# Altium schematic sheet Sheet1.SchDoc
size A3
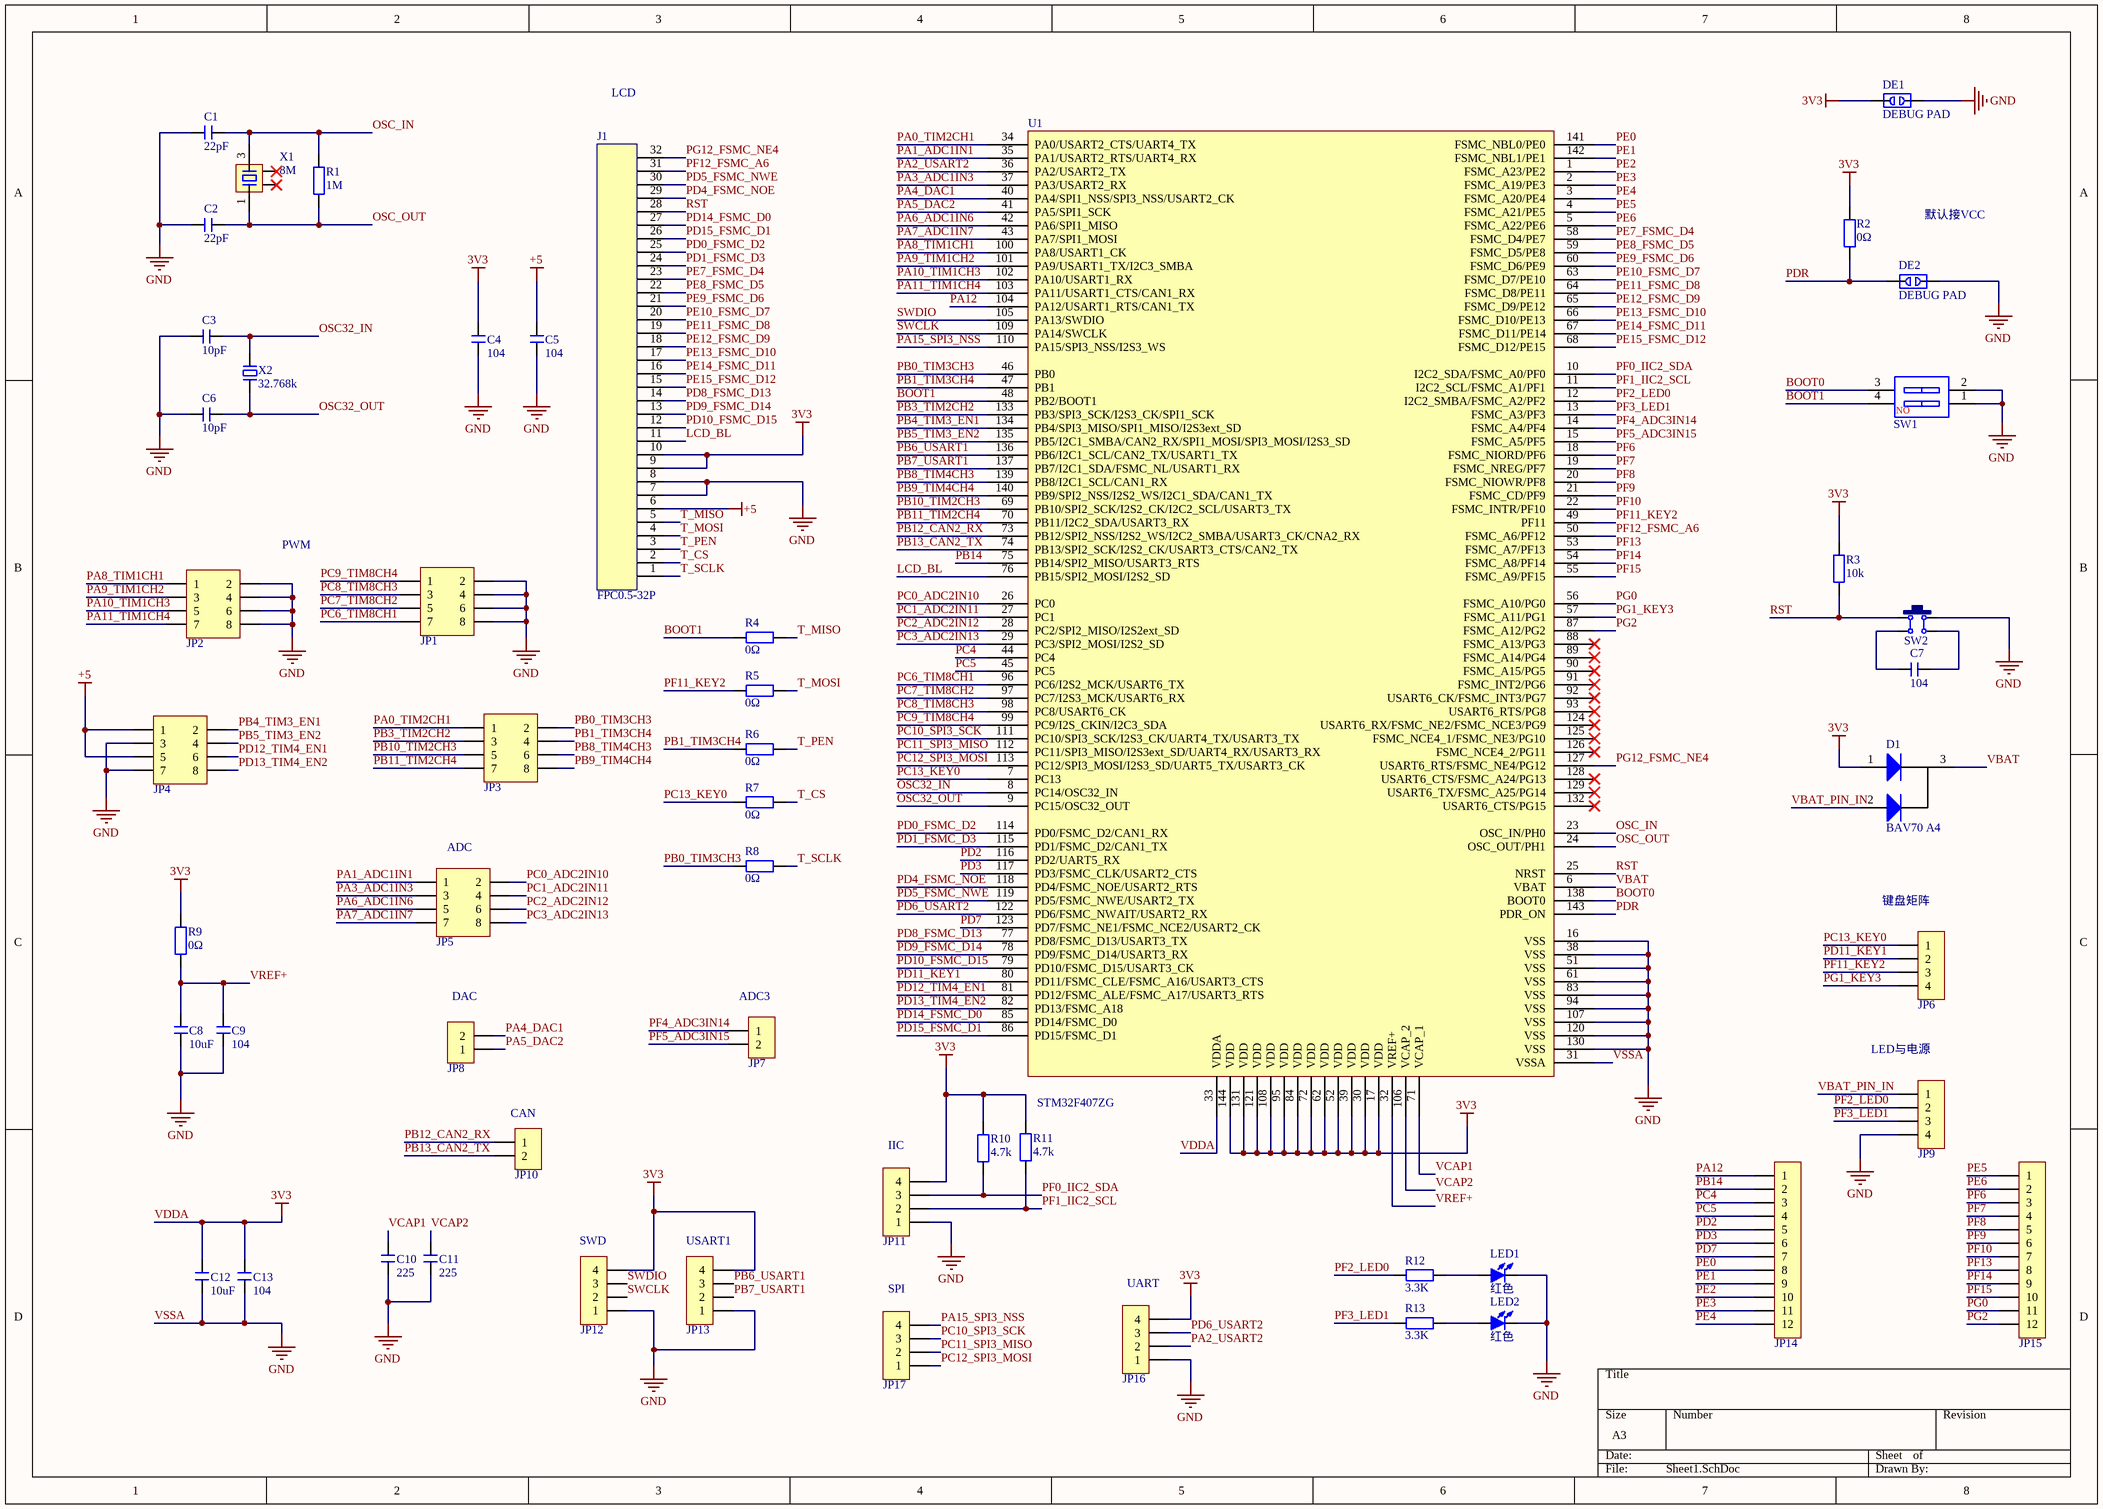
[diagram p0: Sheet1.SchDoc]

## Parts
C1  22pF  [C 0603_L]
C2  22pF  [C 0603_L]
C3  10pF  [C 0603_L]
C4  104  [C 0603_L]
C5  104  [C 0603_L]
C6  10pF  [C 0603_L]
C7  104  [C 0603_L]
C8  10uF  [C 0603_L]
C9  104  [C 0603_L]
C10  225  [C 0603_L]
C11  225  [C 0603_L]
C12  10uF  [C 0603_L]
C13  104  [C 0603_L]
D1  BAV70 A4  [SOT-23(SOT-23-3)]
DE1  DEBUG PAD  [DEBUG_A]
DE2  DEBUG PAD  [DEBUG_A]
J1  FPC0.5-32P  [FPC0.5-32P]
JP1  Header 4X2  [HDR2.54-LI-2x4P]  (value not drawn)
JP2  Header 4X2  [HDR2.54-LI-2x4P]  (value not drawn)
JP3  Header 4X2  [HDR2.54-LI-2x4P]  (value not drawn)
JP4  Header 4X2  [HDR2.54-LI-2x4P]  (value not drawn)
JP5  Header 4X2  [HDR2.54-LI-2x4P]  (value not drawn)
JP6  HDR-1X4  [HDR2.54-LI-4P]  (value not drawn)
JP7  HDR-1X2  [KF128-3.81-2P]  (value not drawn)
JP8  HDR-1X2  [HDR2.54-LI-2P]  (value not drawn)
JP9  HDR-1X4  [HDR2.54-LI-4P]  (value not drawn)
JP10  HDR-1X2  [KF350-2P]  (value not drawn)
JP11  HDR-1X4  [HDR2.54-LI-4P]  (value not drawn)
JP12  HDR-1X4  [HDR2.54-LI-4P]  (value not drawn)
JP13  HDR-1X4  [HDR2.54-LI-4P]  (value not drawn)
JP14  HDR-1X12  [HDR2.54-LI-12P]  (value not drawn)
JP15  HDR-1X12  [HDR2.54-LI-12P]  (value not drawn)
JP16  HDR-1X4  [HDR2.54-LI-4P]  (value not drawn)
JP17  HDR-1X4  [HDR2.54-LI-4P]  (value not drawn)
LED1  红色  [LED 0603R]
LED2  红色  [LED 0603B]
R1  1M  [R 0603_L]
R2  0Ω  [R 0603_L]
R3  10k  [R 0603_L]
R4  0Ω  [R 0603_L]
R5  0Ω  [R 0603_L]
R6  0Ω  [R 0603_L]
R7  0Ω  [R 0603_L]
R8  0Ω  [R 0603_L]
R9  0Ω  [R 0603_L]
R10  4.7k  [R 0603_L]
R11  4.7k  [R 0603_L]
R12  3.3K  [R 0603_L]
R13  3.3K  [R 0603_L]
SW1  CSW-2P  [CSW DIP-2P]  (value not drawn)
SW2  6x6x5  [TSW SMD-6*6*4.3]  (value not drawn)
U1  STM32F407ZG  [LQFP144 20X20_L]
X1  8M  [OSC 1612-4P]
X2  32.768k  [OSC HC-49S]

## Nets
+5: C5.2 J1.6 JP4.1 JP4.5
VDDA: C4.2 C12.2 C13.2 D1.1(A) DE1.1 J1.9 J1.10 JP11.4 JP12.4 JP13.4 JP16.4 R2.2 R3.1 R9.2 R10.1 R11.1 U1.17(VDD) U1.30(VDD) U1.33(VDDA) U1.39(VDD) U1.52(VDD) U1.62(VDD) U1.72(VDD) U1.84(VDD) U1.95(VDD) U1.108(VDD) U1.121(VDD) U1.131(VDD) U1.144(VDD)  [also labelled 3V3]
VSSA: C1.2 C2.2 C3.2 C4.1 C5.1 C6.2 C8.1 C9.1 C10.1 C11.1 C12.1 C13.1 DE1.2 DE2.2 J1.7 J1.8 JP1.2 JP1.4 JP1.6 JP1.8 JP2.2 JP2.4 JP2.6 JP2.8 JP4.3 JP4.7 JP9.4 JP11.1 JP12.1 JP13.1 JP16.1 LED1.2(K) LED2.2(K) SW1.1 SW1.2 SW2.2 U1.16(VSS) U1.31(VSSA) U1.38(VSS) U1.51(VSS) U1.61(VSS) U1.83(VSS) U1.94(VSS) U1.107(VSS) U1.120(VSS) U1.130(VSS)  [also labelled GND]
BOOT0: SW1.3 U1.138(BOOT0)
BOOT1: R4.2 SW1.4 U1.48(PB2/BOOT1)
LCD_BL: J1.11 U1.76(PB15/SPI2_MOSI/I2S2_SD)
OSC32_IN: C3.1 U1.8(PC14/OSC32_IN) X2.2
OSC32_OUT: C6.1 U1.9(PC15/OSC32_OUT) X2.1
OSC_IN: C1.1 R1.1 U1.23(OSC_IN/PH0) X1.3
OSC_OUT: C2.1 R1.2 U1.24(OSC_OUT/PH1) X1.1
PA0_TIM2CH1: JP3.1 U1.34(PA0/USART2_CTS/UART4_TX)
PA1_ADC1IN1: JP5.1 U1.35(PA1/USART2_RTS/UART4_RX)
PA2_USART2: JP16.2 U1.36(PA2/USART2_TX)
PA3_ADC1IN3: JP5.3 U1.37(PA3/USART2_RX)
PA4_DAC1: JP8.2 U1.40(PA4/SPI1_NSS/SPI3_NSS/USART2_CK)
PA5_DAC2: JP8.1 U1.41(PA5/SPI1_SCK)
PA6_ADC1IN6: JP5.5 U1.42(PA6/SPI1_MISO)
PA7_ADC1IN7: JP5.7 U1.43(PA7/SPI1_MOSI)
PA8_TIM1CH1: JP2.1 U1.100(PA8/USART1_CK)
PA9_TIM1CH2: JP2.3 U1.101(PA9/USART1_TX/I2C3_SMBA)
PA10_TIM1CH3: JP2.5 U1.102(PA10/USART1_RX)
PA11_TIM1CH4: JP2.7 U1.103(PA11/USART1_CTS/CAN1_RX)
PA12: JP14.1 U1.104(PA12/USART1_RTS/CAN1_TX)
PA15_SPI3_NSS: JP17.4 U1.110(PA15/SPI3_NSS/I2S3_WS)
PB0_TIM3CH3: JP3.2 R8.2 U1.46(PB0)
PB1_TIM3CH4: JP3.4 R6.2 U1.47(PB1)
PB3_TIM2CH2: JP3.3 U1.133(PB3/SPI3_SCK/I2S3_CK/SPI1_SCK)
PB4_TIM3_EN1: JP4.2 U1.134(PB4/SPI3_MISO/SPI1_MISO/I2S3ext_SD)
PB5_TIM3_EN2: JP4.4 U1.135(PB5/I2C1_SMBA/CAN2_RX/SPI1_MOSI/SPI3_MOSI/I2S3_SD)
PB6_USART1: JP13.3 U1.136(PB6/I2C1_SCL/CAN2_TX/USART1_TX)
PB7_USART1: JP13.2 U1.137(PB7/I2C1_SDA/FSMC_NL/USART1_RX)
PB8_TIM4CH3: JP3.6 U1.139(PB8/I2C1_SCL/CAN1_RX)
PB9_TIM4CH4: JP3.8 U1.140(PB9/SPI2_NSS/I2S2_WS/I2C1_SDA/CAN1_TX)
PB10_TIM2CH3: JP3.5 U1.69(PB10/SPI2_SCK/I2S2_CK/I2C2_SCL/USART3_TX)
PB11_TIM2CH4: JP3.7 U1.70(PB11/I2C2_SDA/USART3_RX)
PB12_CAN2_RX: JP10.1 U1.73(PB12/SPI2_NSS/I2S2_WS/I2C2_SMBA/USART3_CK/CNA2_RX)
PB13_CAN2_TX: JP10.2 U1.74(PB13/SPI2_SCK/I2S2_CK/USART3_CTS/CAN2_TX)
PB14: JP14.2 U1.75(PB14/SPI2_MISO/USART3_RTS)
PC0_ADC2IN10: JP5.2 U1.26(PC0)
PC1_ADC2IN11: JP5.4 U1.27(PC1)
PC2_ADC2IN12: JP5.6 U1.28(PC2/SPI2_MISO/I2S2ext_SD)
PC3_ADC2IN13: JP5.8 U1.29(PC3/SPI2_MOSI/I2S2_SD)
PC4: JP14.3 U1.44(PC4)
PC5: JP14.4 U1.45(PC5)
PC6_TIM8CH1: JP1.7 U1.96(PC6/I2S2_MCK/USART6_TX)
PC7_TIM8CH2: JP1.5 U1.97(PC7/I2S3_MCK/USART6_RX)
PC8_TIM8CH3: JP1.3 U1.98(PC8/USART6_CK)
PC9_TIM8CH4: JP1.1 U1.99(PC9/I2S_CKIN/I2C3_SDA)
PC10_SPI3_SCK: JP17.3 U1.111(PC10/SPI3_SCK/I2S3_CK/UART4_TX/USART3_TX)
PC11_SPI3_MISO: JP17.2 U1.112(PC11/SPI3_MISO/I2S3ext_SD/UART4_RX/USART3_RX)
PC12_SPI3_MOSI: JP17.1 U1.113(PC12/SPI3_MOSI/I2S3_SD/UART5_TX/USART3_CK)
PC13_KEY0: JP6.1 R7.2 U1.7(PC13)
PD0_FSMC_D2: J1.25 U1.114(PD0/FSMC_D2/CAN1_RX)
PD1_FSMC_D3: J1.24 U1.115(PD1/FSMC_D2/CAN1_TX)
PD2: JP14.5 U1.116(PD2/UART5_RX)
PD3: JP14.6 U1.117(PD3/FSMC_CLK/USART2_CTS)
PD4_FSMC_NOE: J1.29 U1.118(PD4/FSMC_NOE/USART2_RTS)
PD5_FSMC_NWE: J1.30 U1.119(PD5/FSMC_NWE/USART2_TX)
PD6_USART2: JP16.3 U1.122(PD6/FSMC_NWAIT/USART2_RX)
PD7: JP14.7 U1.123(PD7/FSMC_NE1/FSMC_NCE2/USART2_CK)
PD8_FSMC_D13: J1.14 U1.77(PD8/FSMC_D13/USART3_TX)
PD9_FSMC_D14: J1.13 U1.78(PD9/FSMC_D14/USART3_RX)
PD10_FSMC_D15: J1.12 U1.79(PD10/FSMC_D15/USART3_CK)
PD11_KEY1: JP6.2 U1.80(PD11/FSMC_CLE/FSMC_A16/USART3_CTS)
PD12_TIM4_EN1: JP4.6 U1.81(PD12/FSMC_ALE/FSMC_A17/USART3_RTS)
PD13_TIM4_EN2: JP4.8 U1.82(PD13/FSMC_A18)
PD14_FSMC_D0: J1.27 U1.85(PD14/FSMC_D0)
PD15_FSMC_D1: J1.26 U1.86(PD15/FSMC_D1)
PDR: DE2.1 R2.1 U1.143(PDR_ON)
PE0: JP14.8 U1.141(FSMC_NBL0/PE0)
PE1: JP14.9 U1.142(FSMC_NBL1/PE1)
PE2: JP14.10 U1.1(FSMC_A23/PE2)
PE3: JP14.11 U1.2(FSMC_A19/PE3)
PE4: JP14.12 U1.3(FSMC_A20/PE4)
PE5: JP15.1 U1.4(FSMC_A21/PE5)
PE6: JP15.2 U1.5(FSMC_A22/PE6)
PE7_FSMC_D4: J1.23 U1.58(FSMC_D4/PE7)
PE8_FSMC_D5: J1.22 U1.59(FSMC_D5/PE8)
PE9_FSMC_D6: J1.21 U1.60(FSMC_D6/PE9)
PE10_FSMC_D7: J1.20 U1.63(FSMC_D7/PE10)
PE11_FSMC_D8: J1.19 U1.64(FSMC_D8/PE11)
PE12_FSMC_D9: J1.18 U1.65(FSMC_D9/PE12)
PE13_FSMC_D10: J1.17 U1.66(FSMC_D10/PE13)
PE14_FSMC_D11: J1.16 U1.67(FSMC_D11/PE14)
PE15_FSMC_D12: J1.15 U1.68(FSMC_D12/PE15)
PF0_IIC2_SDA: JP11.3 R10.2 U1.10(I2C2_SDA/FSMC_A0/PF0)
PF1_IIC2_SCL: JP11.2 R11.2 U1.11(I2C2_SCL/FSMC_A1/PF1)
PF2_LED0: JP9.2 R12.1 U1.12(I2C2_SMBA/FSMC_A2/PF2)
PF3_LED1: JP9.3 R13.1 U1.13(FSMC_A3/PF3)
PF4_ADC3IN14: JP7.1 U1.14(FSMC_A4/PF4)
PF5_ADC3IN15: JP7.2 U1.15(FSMC_A5/PF5)
PF6: JP15.3 U1.18(FSMC_NIORD/PF6)
PF7: JP15.4 U1.19(FSMC_NREG/PF7)
PF8: JP15.5 U1.20(FSMC_NIOWR/PF8)
PF9: JP15.6 U1.21(FSMC_CD/PF9)
PF10: JP15.7 U1.22(FSMC_INTR/PF10)
PF11_KEY2: JP6.3 R5.2 U1.49(PF11)
PF12_FSMC_A6: J1.31 U1.50(FSMC_A6/PF12)
PF13: JP15.8 U1.53(FSMC_A7/PF13)
PF14: JP15.9 U1.54(FSMC_A8/PF14)
PF15: JP15.10 U1.55(FSMC_A9/PF15)
PG0: JP15.11 U1.56(FSMC_A10/PG0)
PG1_KEY3: JP6.4 U1.57(FSMC_A11/PG1)
PG2: JP15.12 U1.87(FSMC_A12/PG2)
PG12_FSMC_NE4: J1.32 U1.127(USART6_RTS/FSMC_NE4/PG12)
RST: J1.28 R3.2 SW2.1 U1.25(NRST)
SWCLK: JP12.2 U1.109(PA14/SWCLK)
SWDIO: JP12.3 U1.105(PA13/SWDIO)
T_CS: J1.2 R7.1
T_MISO: J1.5 R4.1
T_MOSI: J1.4 R5.1
T_PEN: J1.3 R6.1
T_SCLK: J1.1 R8.1
VBAT: D1.3(K) U1.6(VBAT)
VBAT_PIN_IN: D1.2(A) JP9.1
VCAP1: C10.2 U1.71(VCAP_1)
VCAP2: C11.2 U1.106(VCAP_2)
VREF+: C8.2 C9.2 R9.1 U1.32(VREF+)
NetC7_1: C7.1 SW2.4
NetC7_2: C7.2 SW2.3
NetLED1_1: LED1.1(A) R12.2
NetLED2_1: LED2.1(A) R13.2

Not connected (* = marked no-connect by the designer): U1 88(FSMC_A13/PG3)* 89(FSMC_A14/PG4)* 90(FSMC_A15/PG5)* 91(FSMC_INT2/PG6)* 92(USART6_CK/FSMC_INT3/PG7)* 93(USART6_RTS/PG8)* 124(USART6_RX/FSMC_NE2/FSMC_NCE3/PG9)* 125(FSMC_NCE4_1/FSMC_NE3/PG10)* 126(FSMC_NCE4_2/PG11)* 128(USART6_CTS/FSMC_A24/PG13)* 129(USART6_TX/FSMC_A25/PG14)* 132(USART6_CTS/PG15)*; X1 2* 4*

## Notes on the sheet
- LCD
- 默认接VCC
- (near JP2) PWM
- (near JP5) ADC
- (near JP6) 键盘矩阵
- (near JP8) DAC
- (near JP7) ADC3
- LED与电源
- (near JP10) CAN
- (near JP11) IIC
- (near JP12) SWD
- (near JP13) USART1
- (near JP17) SPI
- (near JP16) UART
- (in symbol CSW-2P) NO

## Library data of the parts
C1-C13 = C: 无极性贴片电容; 版权归属: 源创客; BOM名称: 无极性贴片电容; 学习资源: www.ooocke.com
D1 = SOT-23 BAV70 A4: 开关二极管; ComponentLink1Description: 供应商链接; ComponentLink1URL: http://www.szlcsc.com/product/details_70091.html; Package: SOT-23; Supplier: LC; SuppliersPartNumber: C68978
DE1 DE2 = DEBUG: 调试断点焊盘; 版权归属: 源创客; BOM名称: 调试断点焊盘; 学习资源: www.ooocke.com
J1 = FPC0.5-32P: 贴片
JP1-JP5 = Header 4X2: 4*2P接插件; 版权归属: 源创客; BOM名称: 4*2P接插件; 学习资源: www.ooocke.com
JP6 JP9 JP11-JP13 JP16 JP17 = Header 4: 4P接插件; 版权归属: 源创客; BOM名称: 4P接插件; 学习资源: www.ooocke.com
JP7 JP8 JP10 = Header 2: 2P接插件; 版权归属: 源创客; BOM名称: 2P接插件; 学习资源: www.ooocke.com
JP14 JP15 = Header 12: 12P接插件; 版权归属: 源创客; BOM名称: 12P接插件; 学习资源: www.ooocke.com
LED1 LED2 = LED-SMD: 贴片LED; 版权归属: 源创客; BOM名称: 贴片LED; 学习资源: www.ooocke.com
R1-R13 = R: 贴片电阻; 版权归属: 源创客; BOM名称: 贴片电阻; 学习资源: www.ooocke.com
SW1 = CSW-2P: 2路编码开关; 版权归属: 源创客; BOM名称: 2路编码开关; 学习资源: www.ooocke.com
SW2 = TSW SMD-6x6: 贴片6x6轻触开关; 版权归属: 源创客; BOM名称: 贴片6x6轻触开关; 学习资源: www.ooocke.com
U1 = STM32F407ZG: Flaah:1024/RAM:192/IO:114; BOM名称: 32位ST单片机; 版权归属: 源创客; 学习资源: www.ooocke.com
X1 = XTAL-4P: 4脚无源晶振; 版权归属: 源创客; BOM名称: 4脚无源晶振; 学习资源: www.ooocke.com
X2 = XTAL-2P: 2脚无源脚晶振; 版权归属: 源创客; BOM名称: 2脚无源脚晶振; 学习资源: www.ooocke.com